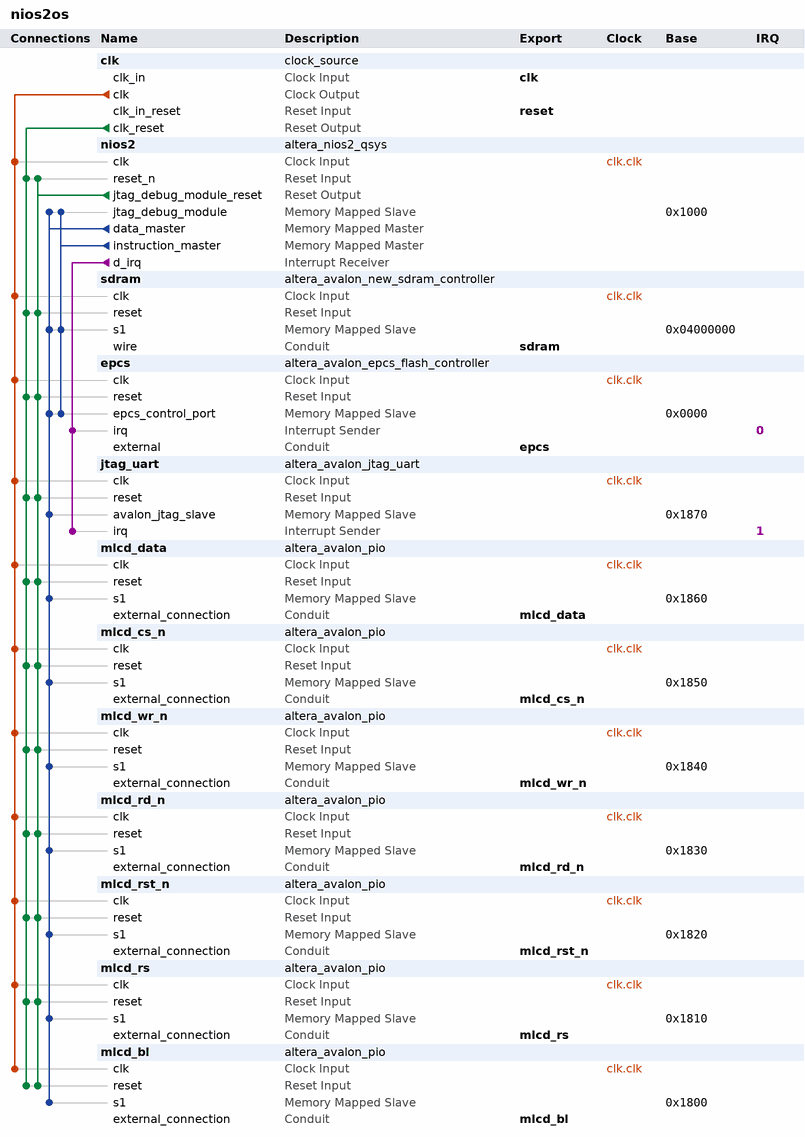
[diagram p0: system contents]
# Platform Designer (Qsys) system nios2os, Cyclone IV E EP4CE10F17C8
# Parameters at their usual value, and those the tool derives, are not listed.
package require -exact qsys 13.1
create_system nios2os
set_project_property DEVICE_FAMILY {Cyclone IV E}
set_project_property DEVICE EP4CE10F17C8

add_instance clk clock_source 13.1
set_instance_parameter_value clk clockFrequency 100000000
set_instance_parameter_value clk resetSynchronousEdges DEASSERT

add_instance nios2 altera_nios2_qsys 13.1
set_instance_parameter_value nios2 muldiv_divider true
set_instance_parameter_value nios2 resetSlave epcs.epcs_control_port
set_instance_parameter_value nios2 mmu_TLBMissExcSlave None
set_instance_parameter_value nios2 exceptionSlave sdram.s1
set_instance_parameter_value nios2 breakSlave nios2.jtag_debug_module
set_instance_parameter_value nios2 impl Fast
set_instance_parameter_value nios2 icache_size 4096

add_instance sdram altera_avalon_new_sdram_controller 13.1
set_instance_parameter_value sdram TAC 5.4
set_instance_parameter_value sdram TRCD 20.0
set_instance_parameter_value sdram TRFC 64.0
set_instance_parameter_value sdram TRP 20.0
set_instance_parameter_value sdram TWR 20.0
set_instance_parameter_value sdram casLatency 3
set_instance_parameter_value sdram columnWidth 9
set_instance_parameter_value sdram dataWidth 16
set_instance_parameter_value sdram generateSimulationModel false
set_instance_parameter_value sdram initRefreshCommands 8
set_instance_parameter_value sdram model single_Micron_MT48LC4M32B2_7_chip
set_instance_parameter_value sdram numberOfBanks 4
set_instance_parameter_value sdram numberOfChipSelects 1
set_instance_parameter_value sdram powerUpDelay 200.0
set_instance_parameter_value sdram refreshPeriod 7.8125
set_instance_parameter_value sdram rowWidth 13

add_instance epcs altera_avalon_epcs_flash_controller 13.1

add_instance jtag_uart altera_avalon_jtag_uart 13.1
set_instance_parameter_value jtag_uart simInteractiveOptions NO_INTERACTIVE_WINDOWS

add_instance mlcd_data altera_avalon_pio 13.1
set_instance_parameter_value mlcd_data direction Bidir
set_instance_parameter_value mlcd_data width 16

add_instance mlcd_cs_n altera_avalon_pio 13.1
set_instance_parameter_value mlcd_cs_n direction Output
set_instance_parameter_value mlcd_cs_n width 1

add_instance mlcd_wr_n altera_avalon_pio 13.1
set_instance_parameter_value mlcd_wr_n direction Output
set_instance_parameter_value mlcd_wr_n width 1

add_instance mlcd_rd_n altera_avalon_pio 13.1
set_instance_parameter_value mlcd_rd_n direction Output
set_instance_parameter_value mlcd_rd_n width 1

add_instance mlcd_rst_n altera_avalon_pio 13.1
set_instance_parameter_value mlcd_rst_n direction Output
set_instance_parameter_value mlcd_rst_n width 1

add_instance mlcd_rs altera_avalon_pio 13.1
set_instance_parameter_value mlcd_rs direction Output
set_instance_parameter_value mlcd_rs width 1

add_instance mlcd_bl altera_avalon_pio 13.1
set_instance_parameter_value mlcd_bl direction Output
set_instance_parameter_value mlcd_bl width 1

# connections
add_connection clk.clk epcs.clk clock
add_connection clk.clk jtag_uart.clk clock
add_connection clk.clk mlcd_bl.clk clock
add_connection clk.clk mlcd_cs_n.clk clock
add_connection clk.clk mlcd_data.clk clock
add_connection clk.clk mlcd_rd_n.clk clock
add_connection clk.clk mlcd_rs.clk clock
add_connection clk.clk mlcd_rst_n.clk clock
add_connection clk.clk mlcd_wr_n.clk clock
add_connection clk.clk nios2.clk clock
add_connection clk.clk sdram.clk clock
add_connection clk.clk_reset epcs.reset reset
add_connection clk.clk_reset jtag_uart.reset reset
add_connection clk.clk_reset mlcd_bl.reset reset
add_connection clk.clk_reset mlcd_cs_n.reset reset
add_connection clk.clk_reset mlcd_data.reset reset
add_connection clk.clk_reset mlcd_rd_n.reset reset
add_connection clk.clk_reset mlcd_rs.reset reset
add_connection clk.clk_reset mlcd_rst_n.reset reset
add_connection clk.clk_reset mlcd_wr_n.reset reset
add_connection clk.clk_reset nios2.reset_n reset
add_connection clk.clk_reset sdram.reset reset
add_connection nios2.jtag_debug_module_reset epcs.reset reset
add_connection nios2.jtag_debug_module_reset jtag_uart.reset reset
add_connection nios2.jtag_debug_module_reset mlcd_bl.reset reset
add_connection nios2.jtag_debug_module_reset mlcd_cs_n.reset reset
add_connection nios2.jtag_debug_module_reset mlcd_data.reset reset
add_connection nios2.jtag_debug_module_reset mlcd_rd_n.reset reset
add_connection nios2.jtag_debug_module_reset mlcd_rs.reset reset
add_connection nios2.jtag_debug_module_reset mlcd_rst_n.reset reset
add_connection nios2.jtag_debug_module_reset mlcd_wr_n.reset reset
add_connection nios2.jtag_debug_module_reset nios2.reset_n reset
add_connection nios2.jtag_debug_module_reset sdram.reset reset
add_connection nios2.data_master epcs.epcs_control_port avalon
set_connection_parameter_value nios2.data_master/epcs.epcs_control_port baseAddress 0x0000
add_connection nios2.data_master jtag_uart.avalon_jtag_slave avalon
set_connection_parameter_value nios2.data_master/jtag_uart.avalon_jtag_slave baseAddress 0x1870
add_connection nios2.data_master mlcd_bl.s1 avalon
set_connection_parameter_value nios2.data_master/mlcd_bl.s1 baseAddress 0x1800
add_connection nios2.data_master mlcd_cs_n.s1 avalon
set_connection_parameter_value nios2.data_master/mlcd_cs_n.s1 baseAddress 0x1850
add_connection nios2.data_master mlcd_data.s1 avalon
set_connection_parameter_value nios2.data_master/mlcd_data.s1 baseAddress 0x1860
add_connection nios2.data_master mlcd_rd_n.s1 avalon
set_connection_parameter_value nios2.data_master/mlcd_rd_n.s1 baseAddress 0x1830
add_connection nios2.data_master mlcd_rs.s1 avalon
set_connection_parameter_value nios2.data_master/mlcd_rs.s1 baseAddress 0x1810
add_connection nios2.data_master mlcd_rst_n.s1 avalon
set_connection_parameter_value nios2.data_master/mlcd_rst_n.s1 baseAddress 0x1820
add_connection nios2.data_master mlcd_wr_n.s1 avalon
set_connection_parameter_value nios2.data_master/mlcd_wr_n.s1 baseAddress 0x1840
add_connection nios2.data_master nios2.jtag_debug_module avalon
set_connection_parameter_value nios2.data_master/nios2.jtag_debug_module baseAddress 0x1000
add_connection nios2.data_master sdram.s1 avalon
set_connection_parameter_value nios2.data_master/sdram.s1 baseAddress 0x04000000
add_connection nios2.instruction_master epcs.epcs_control_port avalon
set_connection_parameter_value nios2.instruction_master/epcs.epcs_control_port baseAddress 0x0000
add_connection nios2.instruction_master nios2.jtag_debug_module avalon
set_connection_parameter_value nios2.instruction_master/nios2.jtag_debug_module baseAddress 0x1000
add_connection nios2.instruction_master sdram.s1 avalon
set_connection_parameter_value nios2.instruction_master/sdram.s1 baseAddress 0x04000000
add_connection nios2.d_irq epcs.irq interrupt
set_connection_parameter_value nios2.d_irq/epcs.irq irqNumber 0
add_connection nios2.d_irq jtag_uart.irq interrupt
set_connection_parameter_value nios2.d_irq/jtag_uart.irq irqNumber 1

# exported interfaces
add_interface clk clock sink
set_interface_property clk EXPORT_OF clk.clk_in
add_interface reset reset sink
set_interface_property reset EXPORT_OF clk.clk_in_reset
add_interface sdram conduit end
set_interface_property sdram EXPORT_OF sdram.wire
add_interface epcs conduit end
set_interface_property epcs EXPORT_OF epcs.external
add_interface mlcd_data conduit end
set_interface_property mlcd_data EXPORT_OF mlcd_data.external_connection
add_interface mlcd_cs_n conduit end
set_interface_property mlcd_cs_n EXPORT_OF mlcd_cs_n.external_connection
add_interface mlcd_wr_n conduit end
set_interface_property mlcd_wr_n EXPORT_OF mlcd_wr_n.external_connection
add_interface mlcd_rd_n conduit end
set_interface_property mlcd_rd_n EXPORT_OF mlcd_rd_n.external_connection
add_interface mlcd_rst_n conduit end
set_interface_property mlcd_rst_n EXPORT_OF mlcd_rst_n.external_connection
add_interface mlcd_rs conduit end
set_interface_property mlcd_rs EXPORT_OF mlcd_rs.external_connection
add_interface mlcd_bl conduit end
set_interface_property mlcd_bl EXPORT_OF mlcd_bl.external_connection

set_interconnect_requirement {$system} qsys_mm.clockCrossingAdapter HANDSHAKE
set_interconnect_requirement {$system} qsys_mm.maxAdditionalLatency 1
set_interconnect_requirement {$system} qsys_mm.insertDefaultSlave false

save_system nios2os.qsys
